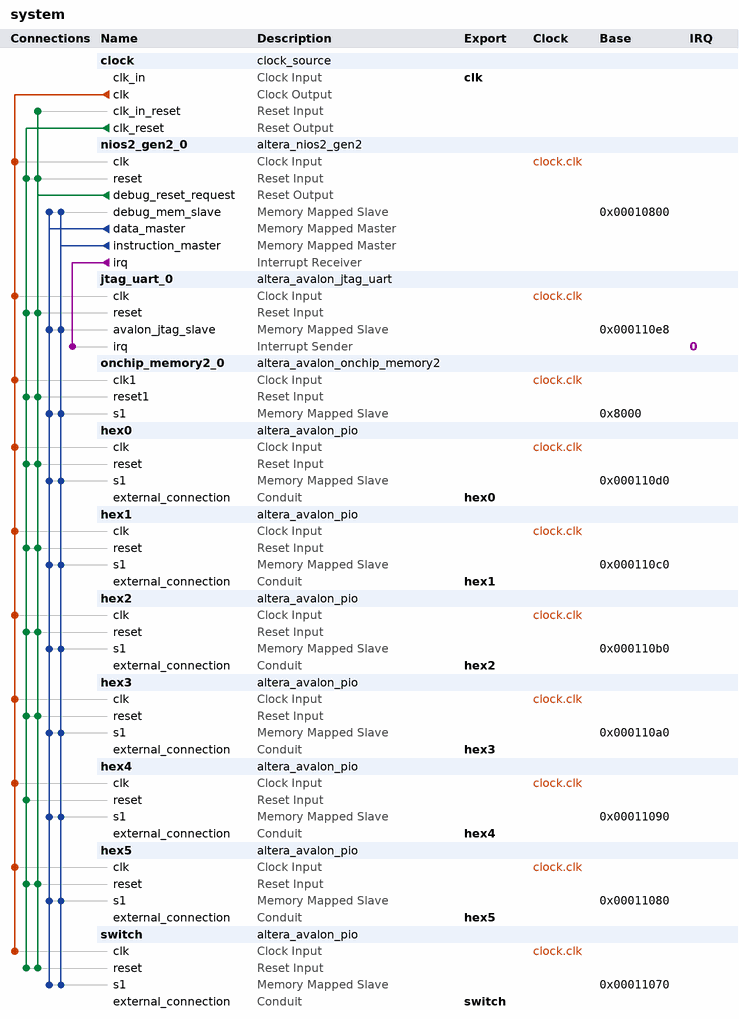
[diagram p0: system contents]
# Platform Designer (Qsys) system system, Cyclone V 5CSXFC6D6F31C6
# Parameters at their usual value, and those the tool derives, are not listed.
package require -exact qsys 18.1
create_system system
set_project_property DEVICE_FAMILY {Cyclone V}
set_project_property DEVICE 5CSXFC6D6F31C6

add_instance clock clock_source 18.1
set_instance_parameter_value clock clockFrequency 50000000

add_instance nios2_gen2_0 altera_nios2_gen2 18.1
set_instance_parameter_value nios2_gen2_0 dcache_size 2048
set_instance_parameter_value nios2_gen2_0 exceptionSlave onchip_memory2_0.s1
set_instance_parameter_value nios2_gen2_0 icache_size 4096
set_instance_parameter_value nios2_gen2_0 impl Tiny
set_instance_parameter_value nios2_gen2_0 resetSlave onchip_memory2_0.s1

add_instance jtag_uart_0 altera_avalon_jtag_uart 18.1
set_instance_parameter_value jtag_uart_0 simInteractiveOptions NO_INTERACTIVE_WINDOWS

add_instance onchip_memory2_0 altera_avalon_onchip_memory2 18.1
set_instance_parameter_value onchip_memory2_0 dataWidth 32
set_instance_parameter_value onchip_memory2_0 dualPort false
set_instance_parameter_value onchip_memory2_0 initMemContent true
set_instance_parameter_value onchip_memory2_0 initializationFileName onchip_mem.hex
set_instance_parameter_value onchip_memory2_0 memorySize 32768

add_instance hex0 altera_avalon_pio 18.1
set_instance_parameter_value hex0 direction Output
set_instance_parameter_value hex0 width 7

add_instance hex1 altera_avalon_pio 18.1
set_instance_parameter_value hex1 direction Output
set_instance_parameter_value hex1 width 7

add_instance hex2 altera_avalon_pio 18.1
set_instance_parameter_value hex2 direction Output
set_instance_parameter_value hex2 width 7

add_instance hex3 altera_avalon_pio 18.1
set_instance_parameter_value hex3 direction Output
set_instance_parameter_value hex3 width 7

add_instance hex4 altera_avalon_pio 18.1
set_instance_parameter_value hex4 direction Output
set_instance_parameter_value hex4 width 7

add_instance hex5 altera_avalon_pio 18.1
set_instance_parameter_value hex5 direction Output
set_instance_parameter_value hex5 width 7

add_instance switch altera_avalon_pio 18.1
set_instance_parameter_value switch direction Input
set_instance_parameter_value switch width 32

# connections
add_connection clock.clk hex0.clk clock
add_connection clock.clk hex1.clk clock
add_connection clock.clk hex2.clk clock
add_connection clock.clk hex3.clk clock
add_connection clock.clk hex4.clk clock
add_connection clock.clk hex5.clk clock
add_connection clock.clk jtag_uart_0.clk clock
add_connection clock.clk nios2_gen2_0.clk clock
add_connection clock.clk onchip_memory2_0.clk1 clock
add_connection clock.clk switch.clk clock
add_connection clock.clk_reset hex0.reset reset
add_connection clock.clk_reset hex1.reset reset
add_connection clock.clk_reset hex2.reset reset
add_connection clock.clk_reset hex3.reset reset
add_connection clock.clk_reset hex4.reset reset
add_connection clock.clk_reset hex5.reset reset
add_connection clock.clk_reset jtag_uart_0.reset reset
add_connection clock.clk_reset nios2_gen2_0.reset reset
add_connection clock.clk_reset onchip_memory2_0.reset1 reset
add_connection clock.clk_reset switch.reset reset
add_connection nios2_gen2_0.debug_reset_request clock.clk_in_reset reset
add_connection nios2_gen2_0.debug_reset_request hex0.reset reset
add_connection nios2_gen2_0.debug_reset_request hex1.reset reset
add_connection nios2_gen2_0.debug_reset_request hex2.reset reset
add_connection nios2_gen2_0.debug_reset_request hex3.reset reset
add_connection nios2_gen2_0.debug_reset_request hex5.reset reset
add_connection nios2_gen2_0.debug_reset_request jtag_uart_0.reset reset
add_connection nios2_gen2_0.debug_reset_request nios2_gen2_0.reset reset
add_connection nios2_gen2_0.debug_reset_request onchip_memory2_0.reset1 reset
add_connection nios2_gen2_0.debug_reset_request switch.reset reset
add_connection nios2_gen2_0.data_master hex0.s1 avalon
set_connection_parameter_value nios2_gen2_0.data_master/hex0.s1 baseAddress 0x000110d0
add_connection nios2_gen2_0.data_master hex1.s1 avalon
set_connection_parameter_value nios2_gen2_0.data_master/hex1.s1 baseAddress 0x000110c0
add_connection nios2_gen2_0.data_master hex2.s1 avalon
set_connection_parameter_value nios2_gen2_0.data_master/hex2.s1 baseAddress 0x000110b0
add_connection nios2_gen2_0.data_master hex3.s1 avalon
set_connection_parameter_value nios2_gen2_0.data_master/hex3.s1 baseAddress 0x000110a0
add_connection nios2_gen2_0.data_master hex4.s1 avalon
set_connection_parameter_value nios2_gen2_0.data_master/hex4.s1 baseAddress 0x00011090
add_connection nios2_gen2_0.data_master hex5.s1 avalon
set_connection_parameter_value nios2_gen2_0.data_master/hex5.s1 baseAddress 0x00011080
add_connection nios2_gen2_0.data_master jtag_uart_0.avalon_jtag_slave avalon
set_connection_parameter_value nios2_gen2_0.data_master/jtag_uart_0.avalon_jtag_slave baseAddress 0x000110e8
add_connection nios2_gen2_0.data_master nios2_gen2_0.debug_mem_slave avalon
set_connection_parameter_value nios2_gen2_0.data_master/nios2_gen2_0.debug_mem_slave baseAddress 0x00010800
add_connection nios2_gen2_0.data_master onchip_memory2_0.s1 avalon
set_connection_parameter_value nios2_gen2_0.data_master/onchip_memory2_0.s1 baseAddress 0x8000
add_connection nios2_gen2_0.data_master switch.s1 avalon
set_connection_parameter_value nios2_gen2_0.data_master/switch.s1 baseAddress 0x00011070
add_connection nios2_gen2_0.instruction_master hex0.s1 avalon
set_connection_parameter_value nios2_gen2_0.instruction_master/hex0.s1 baseAddress 0x000110d0
add_connection nios2_gen2_0.instruction_master hex1.s1 avalon
set_connection_parameter_value nios2_gen2_0.instruction_master/hex1.s1 baseAddress 0x000110c0
add_connection nios2_gen2_0.instruction_master hex2.s1 avalon
set_connection_parameter_value nios2_gen2_0.instruction_master/hex2.s1 baseAddress 0x000110b0
add_connection nios2_gen2_0.instruction_master hex3.s1 avalon
set_connection_parameter_value nios2_gen2_0.instruction_master/hex3.s1 baseAddress 0x000110a0
add_connection nios2_gen2_0.instruction_master hex4.s1 avalon
set_connection_parameter_value nios2_gen2_0.instruction_master/hex4.s1 baseAddress 0x00011090
add_connection nios2_gen2_0.instruction_master hex5.s1 avalon
set_connection_parameter_value nios2_gen2_0.instruction_master/hex5.s1 baseAddress 0x00011080
add_connection nios2_gen2_0.instruction_master jtag_uart_0.avalon_jtag_slave avalon
set_connection_parameter_value nios2_gen2_0.instruction_master/jtag_uart_0.avalon_jtag_slave baseAddress 0x000110e8
add_connection nios2_gen2_0.instruction_master nios2_gen2_0.debug_mem_slave avalon
set_connection_parameter_value nios2_gen2_0.instruction_master/nios2_gen2_0.debug_mem_slave baseAddress 0x00010800
add_connection nios2_gen2_0.instruction_master onchip_memory2_0.s1 avalon
set_connection_parameter_value nios2_gen2_0.instruction_master/onchip_memory2_0.s1 baseAddress 0x8000
add_connection nios2_gen2_0.instruction_master switch.s1 avalon
set_connection_parameter_value nios2_gen2_0.instruction_master/switch.s1 baseAddress 0x00011070
add_connection nios2_gen2_0.irq jtag_uart_0.irq interrupt
set_connection_parameter_value nios2_gen2_0.irq/jtag_uart_0.irq irqNumber 0

# exported interfaces
add_interface clk clock sink
set_interface_property clk EXPORT_OF clock.clk_in
add_interface hex0 conduit end
set_interface_property hex0 EXPORT_OF hex0.external_connection
add_interface hex1 conduit end
set_interface_property hex1 EXPORT_OF hex1.external_connection
add_interface hex2 conduit end
set_interface_property hex2 EXPORT_OF hex2.external_connection
add_interface hex3 conduit end
set_interface_property hex3 EXPORT_OF hex3.external_connection
add_interface hex4 conduit end
set_interface_property hex4 EXPORT_OF hex4.external_connection
add_interface hex5 conduit end
set_interface_property hex5 EXPORT_OF hex5.external_connection
add_interface switch conduit end
set_interface_property switch EXPORT_OF switch.external_connection

set_interconnect_requirement {$system} qsys_mm.clockCrossingAdapter HANDSHAKE
set_interconnect_requirement {$system} qsys_mm.enableEccProtection FALSE
set_interconnect_requirement {$system} qsys_mm.insertDefaultSlave FALSE
set_interconnect_requirement {$system} qsys_mm.maxAdditionalLatency 1

save_system system.qsys
